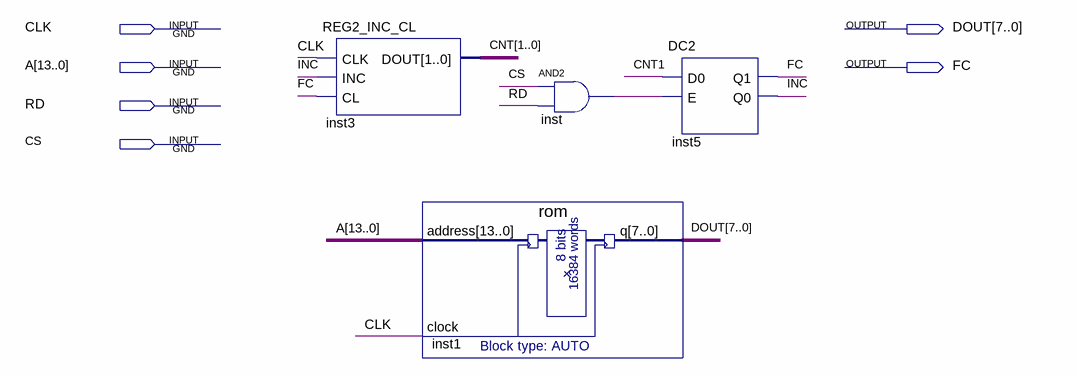
[diagram p0: schematic sheet]
// Quartus schematic rom_controller.bdf as structural Verilog: 4 symbols, 6 pins
module rom_controller (
  input  CLK,
  input  [13:0] A,
  input  RD,
  input  CS,
  output [7:0] DOUT,
  output FC
);

  wire INC, inst_out;
  wire [1:0] CNT;

  REG2_INC_CL inst3 (.CLK(CLK), .INC(INC), .CL(FC), .DOUT(CNT));
  rom inst1 (.address(A), .clock(CLK), .q(DOUT));
  and inst (inst_out, CS, RD);
  DC2 inst5 (.D0(CNT[1]), .E(inst_out), .Q1(FC), .Q0(INC));
endmodule
